# Altium schematic sheet Sheet1.SchDoc
size A; SheetNumber: 1; SheetTotal: 1
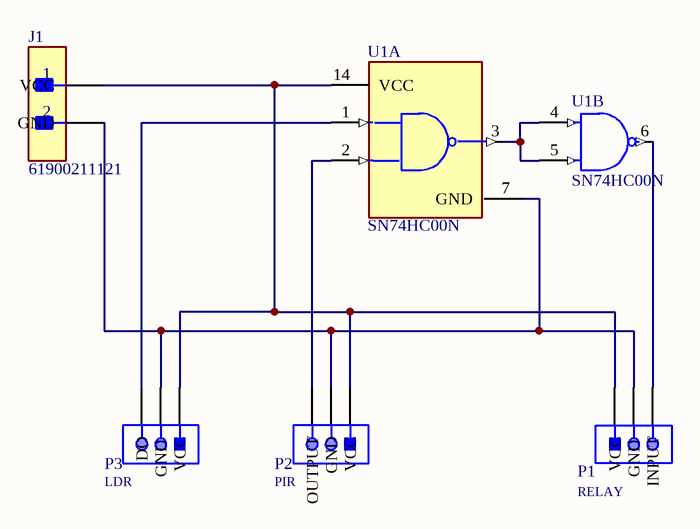
[diagram p0: Sheet1.SchDoc]

## Parts
J1  61900211121  [FP-61900211121-MFG]
P1  RELAY  [61900311121]
P2  PIR  [61900311121]
P3  LDR  [61900311121]
U1  SN74HC00N  [FP-N0014A-MFG]  (parts A,B of 4)

## Nets
NetJ1_1: J1.1(VCC) P1.1(VCC) P2.1(VCC) P3.1(VCC) U1.14(VCC)
NetJ1_2: J1.2(GND) P1.2(GND) P2.2(GND) P3.2(GND) U1.7(GND)
NetP1_3: P1.3(INPUT) U1.6(2Y)
NetP2_3: P2.3(OUTPUT) U1.2(1B)
NetP3_3: P3.3(DO) U1.1(1A)
NetU1_3: U1.3(1Y) U1.4(2A) U1.5(2B)

## Library data of the parts
J1 = CMP-1502-00584-2: CONN HEADER VERT 2POS 2.54MM; Number of Contacts: 2; Gender: Male; Current Rating: 3A; Voltage Rating: 250V; Insulation Resistance: 1GR; Contact Material: Copper Alloy; Package Quantity: 1000; Color: Beige; Mount: Through Hole; Termination: Through Hole; Fastening Type: Friction; Contact Mating Length: 0.295inch; Pitch: 2.54mm; Max Operating Temperature: 105°C; Height: 14.2mm; RoHS Compliant: Yes; Packaging: Bulk; Contact Type: Male Pin; Width: 5.12mm; Housing Material: Nylon; Min Operating Temperature: -40°C; Insulation Material: Nylon; Contact Finish - Mating: TIN; Insulation Color: Beige; Contact Plating: Tin; Flammability Rating: UL94 V-0; Length: 5.8mm; Contact Gender: Male; Connector Type: Header; Contact Shape: Square; Series: WR-WTB; Number of Positions: 2; Number of Rows: 1
P1-P3 = CMP-1502-00585-1: Male Locking Header WR-WTB, THT, Vertical, pitch 2.54 mm, 1 x 3 position; Manufacturer: Wurth Elektronik; Contact Resistance: 20mOhm; Pitch: 2.54mm; Working Voltage: 250VAC; Position: 1x3; Mounting Technology: THT; Operating Temperature: -40to105degC; Part Number: 61900311121; Datasheet URL: https://katalog.we-online.de/em/datasheet/6190xx11121.pdf; Manufacturer URL: http://www.we-online.de; Publisher: WurthElektronik; Orientation: Vertical; Gender: Male; Package Reference: 61900311121; Packaging: Bag
U1 = CMP-1627-00482-3: IC GATE NAND 4CH 2-INP 14DIP; Quiescent Current: 2uA; High Level Output Current: -5.2mA; Schmitt Trigger Input: No; Turn-On Delay Time: 20ns; Number of Input Lines: 2; Number of Elements: 4; Propagation Delay: 15ns; Low Level Output Current: 5.2mA; Operating Supply Voltage: 5V; Min Supply Voltage: 2V; Max Output Current: 4mA; Max Supply Voltage: 6V; Number of Outputs: 1; Width: 6.35mm; Case/Package: PDIP; Logic Function: NAND; Packaging: Rail/Tube; Number of Bits: 4; Weight: 0.032734oz; Mount: Through Hole; Length: 19.3mm; Contact Plating: Gold; Number of Inputs: 2; Radiation Hardening: No; Number of Pins: 14; Package Quantity: 25; Height: 4.57mm; Lead Free: Lead Free; Number of Circuits: 4; Output Current: 5.2mA; Min Operating Temperature: -40°C; REACH SVHC: No SVHC; Number of Output Lines: 1; Max Operating Temperature: 85°C; Number of Gates: 4